# EAGLE design Esquema (EAGLE 9.6.2)
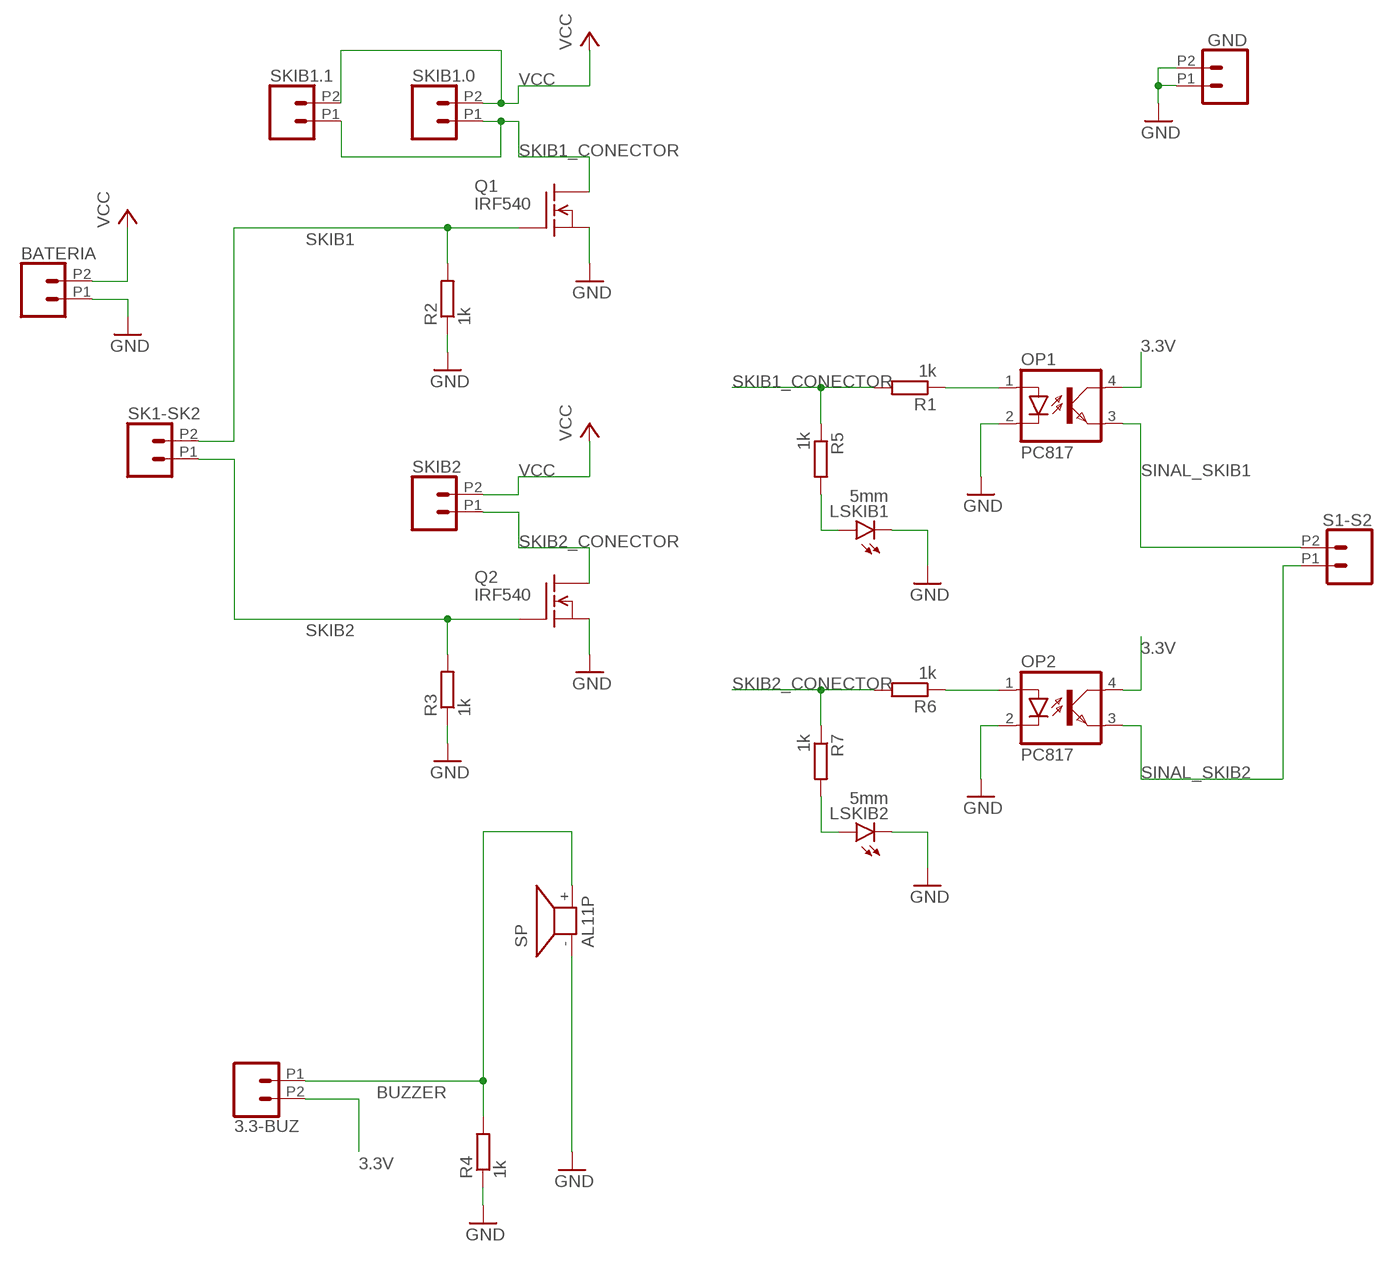
[diagram p0: schematic, sheet 1]

## Parts
3.3-BUZ  CONN_022.54MM_SCREWTERM  [1X02_2.54_SCREWTERM]
BATERIA  CONN_022.54MM_SCREWTERM  [1X02_2.54_SCREWTERM]
GND  CONN_022.54MM_SCREWTERM  [1X02_2.54_SCREWTERM]
LSKIB1  5mm  LED5MM  [LED5MM]
LSKIB2  5mm  LED5MM  [LED5MM]
OP1  PC817  [DIL04]
OP2  PC817  [DIL04]
Q1  IRF540  [TO220]
Q2  IRF540  [TO220]
R1  1k  R-EU_0207/10  [0207/10]
R2  1k  R-EU_0207/10  [0207/10]
R3  1k  R-EU_0207/10  [0207/10]
R4  1k  R-EU_0207/10  [0207/10]
R5  1k  R-EU_0207/10  [0207/10]
R6  1k  R-EU_0207/10  [0207/10]
R7  1k  R-EU_0207/10  [0207/10]
S1-S2  CONN_022.54MM_SCREWTERM  [1X02_2.54_SCREWTERM]
SK1-SK2  CONN_022.54MM_SCREWTERM  [1X02_2.54_SCREWTERM]
SKIB1.0  CONN_022.54MM_SCREWTERM  [1X02_2.54_SCREWTERM]
SKIB1.1  CONN_022.54MM_SCREWTERM  [1X02_2.54_SCREWTERM]
SKIB2  CONN_022.54MM_SCREWTERM  [1X02_2.54_SCREWTERM]
SP  AL11P  [AL11P]

## Nets
3.3V: 3.3-BUZ.P2 OP1.4(COL) OP2.4(COL)
BUZZER: 3.3-BUZ.P1 R4.2 SP.+
GND: BATERIA.P1 GND.P1 GND.P2 LSKIB1.K(C) LSKIB2.K(C) OP1.2(C) OP2.2(C) Q1.3(S) Q2.3(S) R2.1 R3.1 R4.1 SP.-
N$1: LSKIB2.A R7.2
N$3: LSKIB1.A R5.2
N$4: OP1.1(A) R1.1
N$5: OP2.1(A) R6.1
SINAL_SKIB1: OP1.3(EMIT) S1-S2.P2
SINAL_SKIB2: OP2.3(EMIT) S1-S2.P1
SKIB1: Q1.1(G) R2.2 SK1-SK2.P2
SKIB1_CONECTOR: Q1.2(D) R1.2 R5.1 SKIB1.0.P1 SKIB1.1.P1
SKIB2: Q2.1(G) R3.2 SK1-SK2.P1
SKIB2_CONECTOR: Q2.2(D) R6.2 R7.1 SKIB2.P1
VCC: BATERIA.P2 SKIB1.0.P2 SKIB1.1.P2 SKIB2.P2

## Library data of the parts
3.3-BUZ BATERIA GND S1-S2 SK1-SK2 SKIB1.0 SKIB1.1 SKIB2 = SparkFun-Connectors:CONN_02: Multi connection point. Often used as Generic Header-pin footprint for 0.1 inch spaced/style header connections On any of the 0.1 inch spaced packages, you can populate with these: Break Away Headers - Straight <https://www.sparkfun.com/products/116> (PRT-00116) Break Away Male Headers - Right Angle <https://www.sparkfun.com/products/553> (PRT-00553) Female Headers <https://www.sparkfun.com/products/115> (PRT-00115) Break Away Headers - Machine Pin <https://www.sparkfun.com/products/117> (PRT-00117) Break Away Female Headers - Swiss Machine Pin <https://www.sparkfun.com/products/743> (PRT-00743) For SCREWTERMINALS and SPRING TERMINALS visit here: Screw Terimnals on SparkFun.com <https://www.sparkfun.com/search/results?term=Screw+Terminals> (5mm/3.5mm/2.54mm spacing) This device is also useful as a general connection point to wire up your design to another part of your project. Our various solder wires solder well into these plated through hole pads. Hook-Up Wire - Assortment (Stranded, 22 AWG) <https://www.sparkfun.com/products/11375> (PRT-11375) Hook-Up Wire - Assortment (Solid Core, 22 AWG) <https://www.sparkfun.com/products/11367> (PRT-11367) View the entire wire category on our website here <https://www.sparkfun.com/categories/141> Special notes: Molex polarized connector foot print use with: PRT-08233 with associated crimp pins and housings. 2.54_SCREWTERM for use with PRT-10571. 3.5mm Screw Terminal footprints for PRT-08084 5mm Screw Terminal footprints for use with PRT-08432
LSKIB1 LSKIB2 = led:LED: LED OSRAM: - CHIPLED LG R971, LG N971, LY N971, LG Q971, LY Q971, LO R971, LY R971 LH N974, LH R974 LS Q976, LO Q976, LY Q976 LO Q996 - Hyper CHIPLED LW Q18S LB Q993, LB Q99A, LB R99A - SideLED LS A670, LO A670, LY A670, LG A670, LP A670 LB A673, LV A673, LT A673, LW A673 LH A674 LY A675 LS A676, LA A676, LO A676, LY A676, LW A676 LS A679, LY A679, LG A679 - Hyper Micro SIDELED® LS Y876, LA Y876, LO Y876, LY Y876 LT Y87S - SmartLED LW L88C, LW L88S LB L89C, LB L89S, LG L890 LS L89K, LO L89K, LY L89K LS L896, LA L896, LO L896, LY L896 - TOPLED LS T670, LO T670, LY T670, LG T670, LP T670 LSG T670, LSP T670, LSY T670, LOP T670, LYG T670 LG T671, LOG T671, LSG T671 LB T673, LV T673, LT T673, LW T673 LH T674 LS T676, LA T676, LO T676, LY T676, LB T676, LH T676, LSB T676, LW T676 LB T67C, LV T67C, LT T67C, LS T67K, LO T67K, LY T67K, LW E67C LS E67B, LA E67B, LO E67B, LY E67B, LB E67C, LV E67C, LT E67C LW T67C LS T679, LY T679, LG T679 LS T770, LO T770, LY T770, LG T770, LP T770 LB T773, LV T773, LT T773, LW T773 LH T774 LS E675, LA E675, LY E675, LS T675 LS T776, LA T776, LO T776, LY T776, LB T776 LHGB T686 LT T68C, LB T68C - Hyper Mini TOPLED® LB M676 - Mini TOPLED Santana® LG M470 LS M47K, LO M47K, LY M47K Source: http://www.osram.convergy.de LUXEON: - LUMILED® LXK2-PW12-R00, LXK2-PW12-S00, LXK2-PW14-U00, LXK2-PW14-V00 LXK2-PM12-R00, LXK2-PM12-S00, LXK2-PM14-U00 LXK2-PE12-Q00, LXK2-PE12-R00, LXK2-PE12-S00, LXK2-PE14-T00, LXK2-PE14-U00 LXK2-PB12-K00, LXK2-PB12-L00, LXK2-PB12-M00, LXK2-PB14-N00, LXK2-PB14-P00, LXK2-PB14-Q00 LXK2-PR12-L00, LXK2-PR12-M00, LXK2-PR14-Q00, LXK2-PR14-R00 LXK2-PD12-Q00, LXK2-PD12-R00, LXK2-PD12-S00 LXK2-PH12-R00, LXK2-PH12-S00 LXK2-PL12-P00, LXK2-PL12-Q00, LXK2-PL12-R00 Source: www.luxeon.com KINGBRIGHT: KA-3528ASYC Source: www.kingbright.com
OP1 OP2 = optocoupler:PC817: SHARP OPTO COUPLER; MPN: PC817X4J000F; OC_FARNELL: 9707727; OC_NEWARK: 97K7059
Q1 Q2 = transistor-fet:IRF540: N-Channel Enhancement MOSFET (HEXFET); 100V; 28A; 0,077Ohm
R1-R7 = rcl:R-EU_: RESISTOR, European symbol; SPICEPREFIX: R
SP = buzzer:AL11P: SPEAKER Source: Buerklin; OC_FARNELL: unknown; OC_NEWARK: unknown

## Board
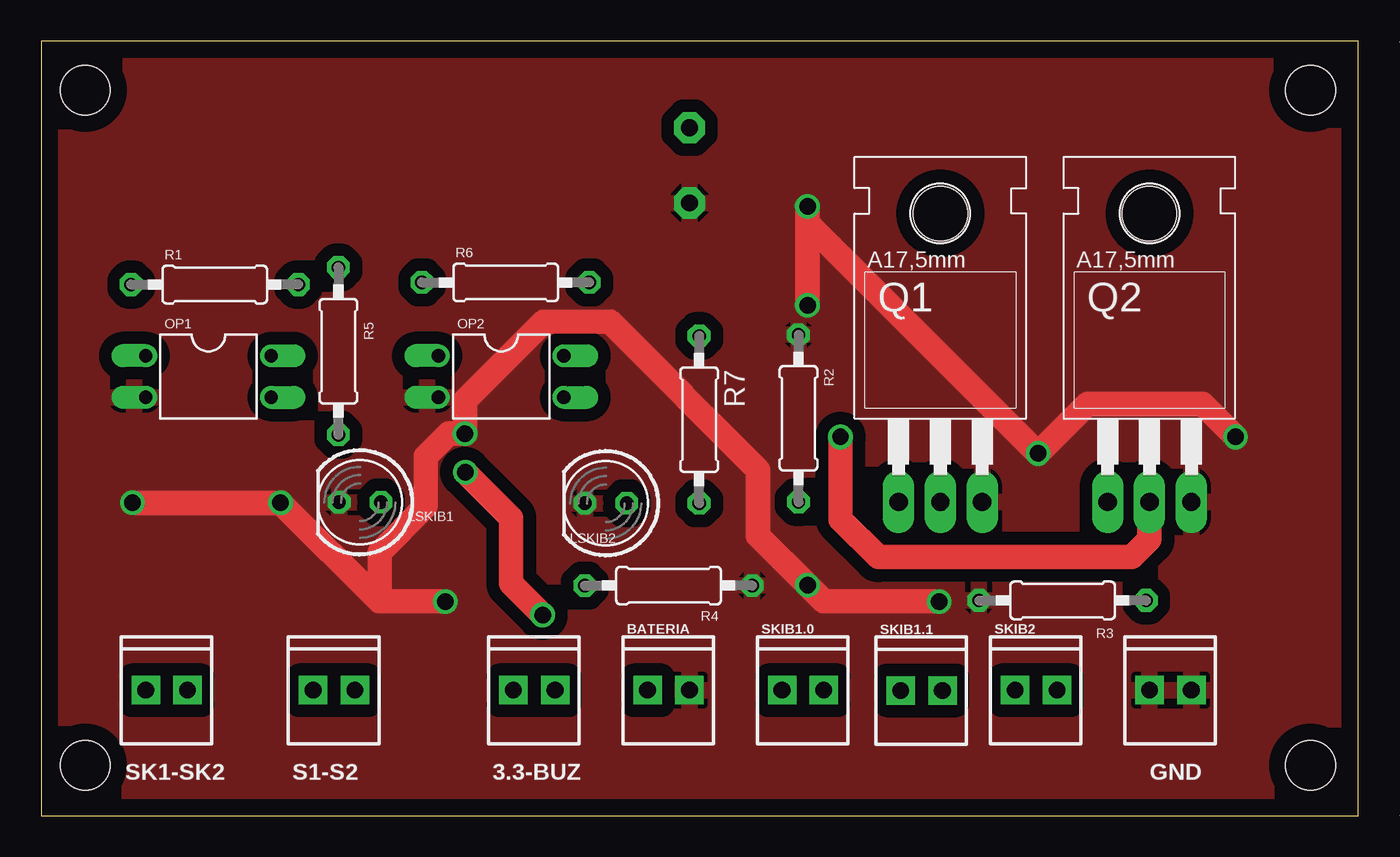
[diagram p1: board, top side]
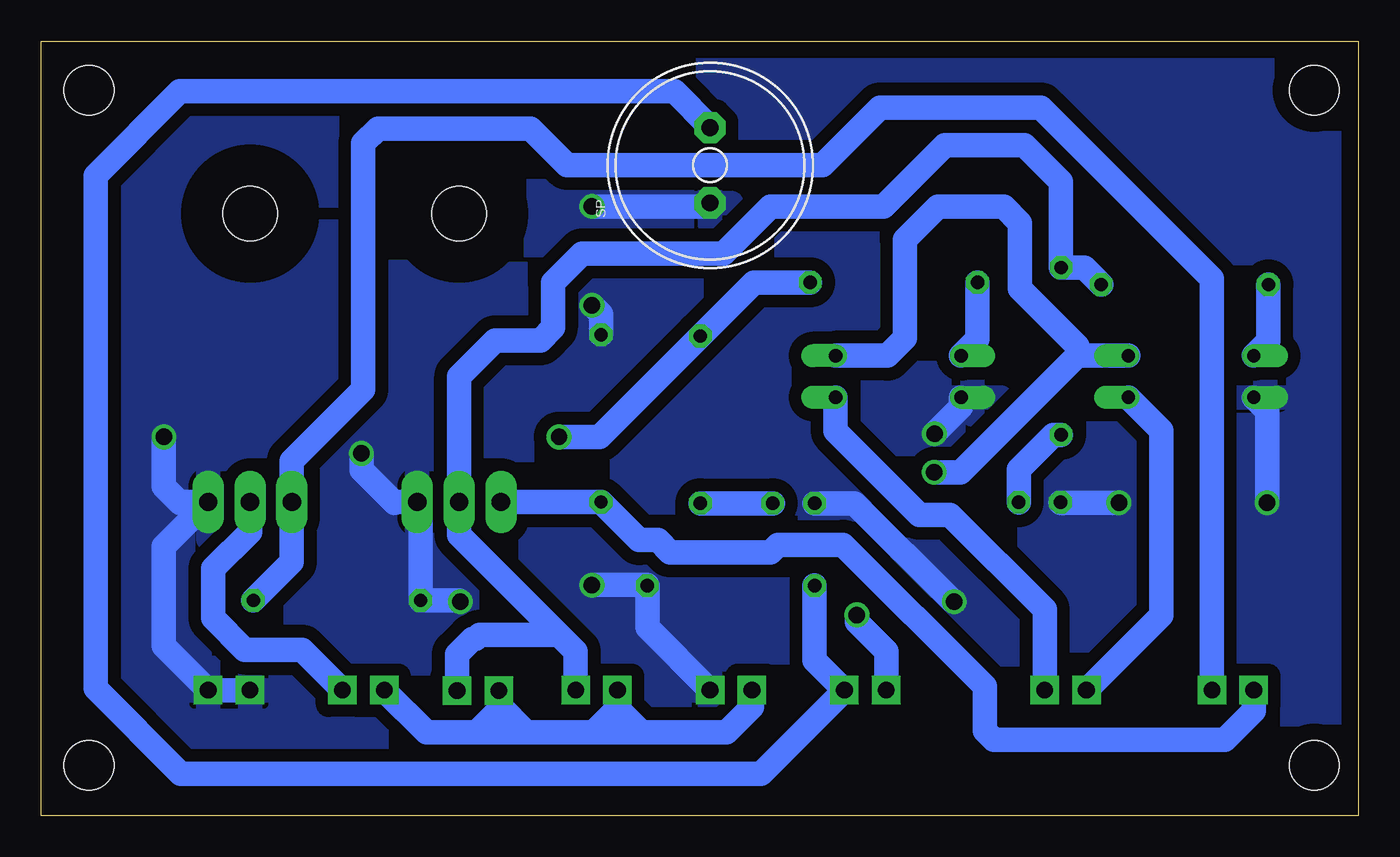
[diagram p2: board, bottom side, seen from below]

Size 79.99 x 47.04 mm. Coordinates in mm from the lower left corner, seen from the top.
Outline: 0,0 79.99,0 79.99,47.04 0,47.04 0,0
Copper layers (1*16): Top 0.035mm / dielectric 1.5mm / Bottom 0.035mm
Design rules "default": minimum track width 1.5mm, minimum drill 1mm, track to track 30mil, track to pad 20mil, pad to pad 6mil, via to via 6mil, smd to smd 6mil, copper to edge 40mil, drill to drill 6mil, minimum pad ring 10mil, minimum via ring 8mil, stop-mask expansion 4mil, vias tented up to drill 0mil, thermal gap 10mil
Holes 3 mm at 2.67,44.07 77.09,44.07 2.67,3.05 77.09,3.05

### Footprints (pad centres in the part's own frame; a part is rotated, then mirrored left to right if it is on the bottom)
1X02_2.54_SCREWTERM = drill 1.016 square: P1 2.54,0; P2 0,0
LED5MM = drill 0.813 octagon: A -1.27,0; K 1.27,0
DIL04 = drill 0.813 offset: 1 -1.27,-3.81; 2 1.27,-3.81; 3 1.27,3.81; 4 -1.27,3.81
TO220 = drill 1.118 long: 1 -2.54,-6.35; 2 0,-6.35; 3 2.54,-6.35 | hole 3.302: 0,11.176
0207/10 = drill 0.813 octagon: 1 -5.08,0; 2 5.08,0
AL11P = drill 1.016 pad 1.905 octagon: + 2.286,0; - -2.286,0

### Placement (x,y rotation side)
3.3-BUZ  28.67,7.62 0 top
BATERIA  36.83,7.62 0 top
GND  67.31,7.62 0 top
LSKIB1  19.36,19.03 180 top
LSKIB2  34.29,18.97 180 top
OP1  10.16,26.67 270 top
OP2  27.94,26.67 270 top
Q1  54.61,25.4 0 top
Q2  67.31,25.4 0 top
R1  10.54,32.26 0 top
R2  45.99,24.13 270 top
R3  62.03,13.07 0 top
R4  38.1,13.97 180 top
R5  18.05,28.21 270 top
R6  28.21,32.38 0 top
R7  39.96,24.05 270 top
S1-S2  16.51,7.62 0 top
SK1-SK2  6.35,7.62 0 top
SKIB1.0  44.99,7.62 0 top
SKIB1.1  52.2,7.59 0 top
SKIB2  59.15,7.62 0 top
SP  39.37,39.5 90 bottom

### Tracks (layer width: path | path; a pad name or v marks a point on that pad's centre or on a via)
3.3V  (via drill 1)
  Top 1.5: v30.45,12.19 28.54,14.1 28.54,18.07 v25.75,20.86
  Bottom 1.5: OP1.4 17.07,27.94 | 17.07,27.94 24.18,20.83 25.72,20.83 v25.75,20.86 | 3.3-BUZ.P2 28.67,9.98 30.45,11.76 v30.45,12.19 | 17.07,27.94 17.07,28.53 20.54,32 20.54,36 21.54,37 25.54,37 27.54,35 27.54,29 28.6,27.94 OP2.4
BUZZER
  Bottom 1.5: R4.2 33.02,9.43 3.3-BUZ.P1 36.29,2.54 71.52,2.54 76.69,7.71 76.69,38.88 71.57,44 41.54,44 39.37,41.83 SP.+
GND  (via drill 1)
  Top 1.5: v54.54,13 47.54,13 v46.54,14 43.54,17 43.54,21 34.54,30 30.54,30 25.74,25.2 v25.74,23.2 24.74,23.2 23.35,21.81 23.35,18.81 20.54,16 20.54,13 | v72.54,23 70.54,25 63.54,25 v60.54,22 46.54,36 v46.54,37 v46.54,31 | v5.54,19 v14.54,19 20.54,13 | v24.54,13 20.54,13
  Bottom 1.5: SP.- 39.58,37 v46.54,37 | v60.54,22 60.54,21 58.54,19 58.49,19.05 Q1.3 56.95,18.85 R3.1 54.61,13.07 v54.54,13 | BATERIA.P1 43.18,11.43 R4.1 43.21,14 v46.54,14 | v72.54,23 72.54,20 71.54,19 71.49,19.05 Q2.3 72.54,16.36 72.54,10.31 GND.P1 GND.P2 | LSKIB1.K 18.06,19 v14.54,19 | OP1.2 5.54,24.59 v5.54,19 | v25.74,23.2 24.13,24.81 OP2.2 | LSKIB2.K 30.59,18.97 24.62,13 v24.54,13 | R2.1 45.99,30.45 v46.54,31
  pour Bottom: 0.38,46.61 0.38,0.38 79.63,0.38 79.63,46.61
  pour Top: 0.54,47 0.54,0 79.54,0 79.54,47
N$1
  Bottom 1.5: R7.2 LSKIB2.A
N$3
  Bottom 1.5: LSKIB1.A 20.63,21.01 18.51,23.13 R5.2
N$4
  Bottom 1.5: OP1.1 5.46,28.83 R1.1
N$5
  Bottom 1.5: R6.1 23.13,28.94 OP2.1
SINAL_SKIB1
  Bottom 1.5: S1-S2.P2 11.97,12.16 11.97,23.4 OP1.3
SINAL_SKIB2
  Bottom 1.5: OP2.3 31.75,23.36 26.66,18.27 24.81,18.27 19.05,12.51 S1-S2.P1
SKIB1
  Bottom 1.5: Q1.1 R2.2 43.67,16.73 42.54,16.73 41.81,16 35.71,16 35.26,16.45 31.29,16.45 22.69,7.85 22.69,5.15 22.13,4.59 8.11,4.59 6.35,6.35 SK1-SK2.P2
SKIB1_CONECTOR
  Bottom 1.5: R1.2 16.65,33.29 R5.1 18.05,38.51 20.28,40.74 25.12,40.74 28.85,37 35.69,37 38.54,34.15 47.13,34.15 48.91,32.37 48.91,29.63 49.67,28.87 52.41,28.87 54.61,26.67 Q1.2 54.61,17.05 48.55,10.99 | SKIB1.0.P1 47.53,9.97 48.55,10.99 | 48.55,10.99 53.35,10.99 53.6,10.74 53.8,10.74 54.73,9.8 SKIB1.1.P1
SKIB2
  Bottom 1.5: R3.2 64.77,15.41 Q2.1 64.77,21.54 60.43,25.89 60.43,40.85 59.54,41.74 50.28,41.74 48.05,39.51 32.54,39.51 29.05,43 19.28,43 8.89,32.61 SK1-SK2.P1
SKIB2_CONECTOR  (via drill 1)
  Top 1.5: Q2.2 67.31,16.77 66.24,15.7 50.84,15.7 48.54,18 v48.54,23
  Bottom 1.5: Q2.2 67.31,17.23 69.54,15 69.54,12 67.62,10.08 64.15,10.08 SKIB2.P1 | v48.54,23 46.09,23 R7.1 36.7,32.38 R6.2
VCC
  Bottom 1.5: BATERIA.P2 36.83,6.62 38.38,5.07 43.54,5.07 | SKIB2.P2 56.59,5.07 53.54,5.07 | 43.54,5.07 46.44,5.07 | 46.44,5.07 50.54,5.07 | 50.54,5.07 53.54,5.07 | SKIB1.0.P2 44.99,6.51 | 44.99,6.51 43.54,5.07 | 44.99,6.51 46.44,5.07 | 52.2,6.72 50.54,5.07 | SKIB1.1.P2 52.2,6.72 | 52.2,6.72 52.2,6.41 53.54,5.07